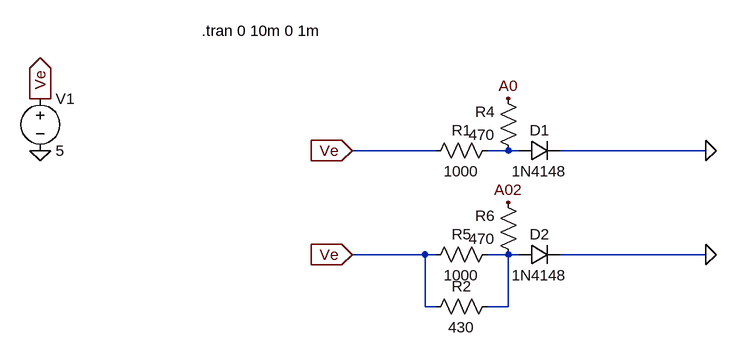
[diagram p0: schematic Sujet2.asc]
Sujet2.asc, the LTspice schematic file:
Version 4
SHEET 1 880 680
WIRE 352 144 224 144
WIRE 464 144 432 144
WIRE 480 144 464 144
WIRE 768 144 544 144
WIRE 336 304 224 304
WIRE 352 304 336 304
WIRE 464 304 432 304
WIRE 480 304 464 304
WIRE 768 304 544 304
WIRE 336 384 336 304
WIRE 352 384 336 384
WIRE 464 384 464 304
WIRE 464 384 432 384
FLAG -256 144 0
FLAG -256 64 Ve
IOPIN -256 64 Out
FLAG 224 144 Ve
IOPIN 224 144 In
FLAG 768 144 0
FLAG 464 64 A0
FLAG 224 304 Ve
IOPIN 224 304 In
FLAG 768 304 0
FLAG 464 224 A02
SYMBOL voltage -256 48 R0
SYMATTR InstName V1
SYMATTR Value 5
SYMBOL diode 480 160 R270
WINDOW 0 32 32 VTop 2
WINDOW 3 0 32 VBottom 2
SYMATTR InstName D1
SYMATTR Value 1N4148
SYMBOL res 448 128 R90
WINDOW 0 0 56 VBottom 2
WINDOW 3 32 56 VTop 2
SYMATTR InstName R1
SYMATTR Value 1000
SYMBOL res 480 160 R180
WINDOW 0 36 76 Left 2
WINDOW 3 36 40 Left 2
SYMATTR InstName R4
SYMATTR Value 470
SYMBOL diode 480 320 R270
WINDOW 0 32 32 VTop 2
WINDOW 3 0 32 VBottom 2
SYMATTR InstName D2
SYMATTR Value 1N4148
SYMBOL res 448 288 R90
WINDOW 0 0 56 VBottom 2
WINDOW 3 32 56 VTop 2
SYMATTR InstName R5
SYMATTR Value 1000
SYMBOL res 480 320 R180
WINDOW 0 36 76 Left 2
WINDOW 3 36 40 Left 2
SYMATTR InstName R6
SYMATTR Value 470
SYMBOL res 448 368 R90
WINDOW 0 0 56 VBottom 2
WINDOW 3 32 56 VTop 2
SYMATTR InstName R2
SYMATTR Value 430
TEXT -8 -40 Left 2 !.tran 0 10m 0 1m

The netlist it stands for:
* Sujet2.asc
V1 Ve 0 5
D1 N001 0 1N4148
R1 N001 Ve 1000
R4 N001 A0 470
D2 N002 0 1N4148
R5 N002 Ve 1000
R6 N002 A02 470
R2 N002 Ve 430
.model D D
.lib standard.dio
.tran 0 10m 0 1m
.backanno
.end